# Altium schematic sheet Sheet1.SchDoc: Flight Computer Prototype
size A4; Organization: Altium Limited; Address1: L3, 12a Rodborough Rd; Address2: Frenchs Forest; Address3: NSW; Address4: Australia 2086; Revision: 1.0; SheetNumber: 1; SheetTotal: 4
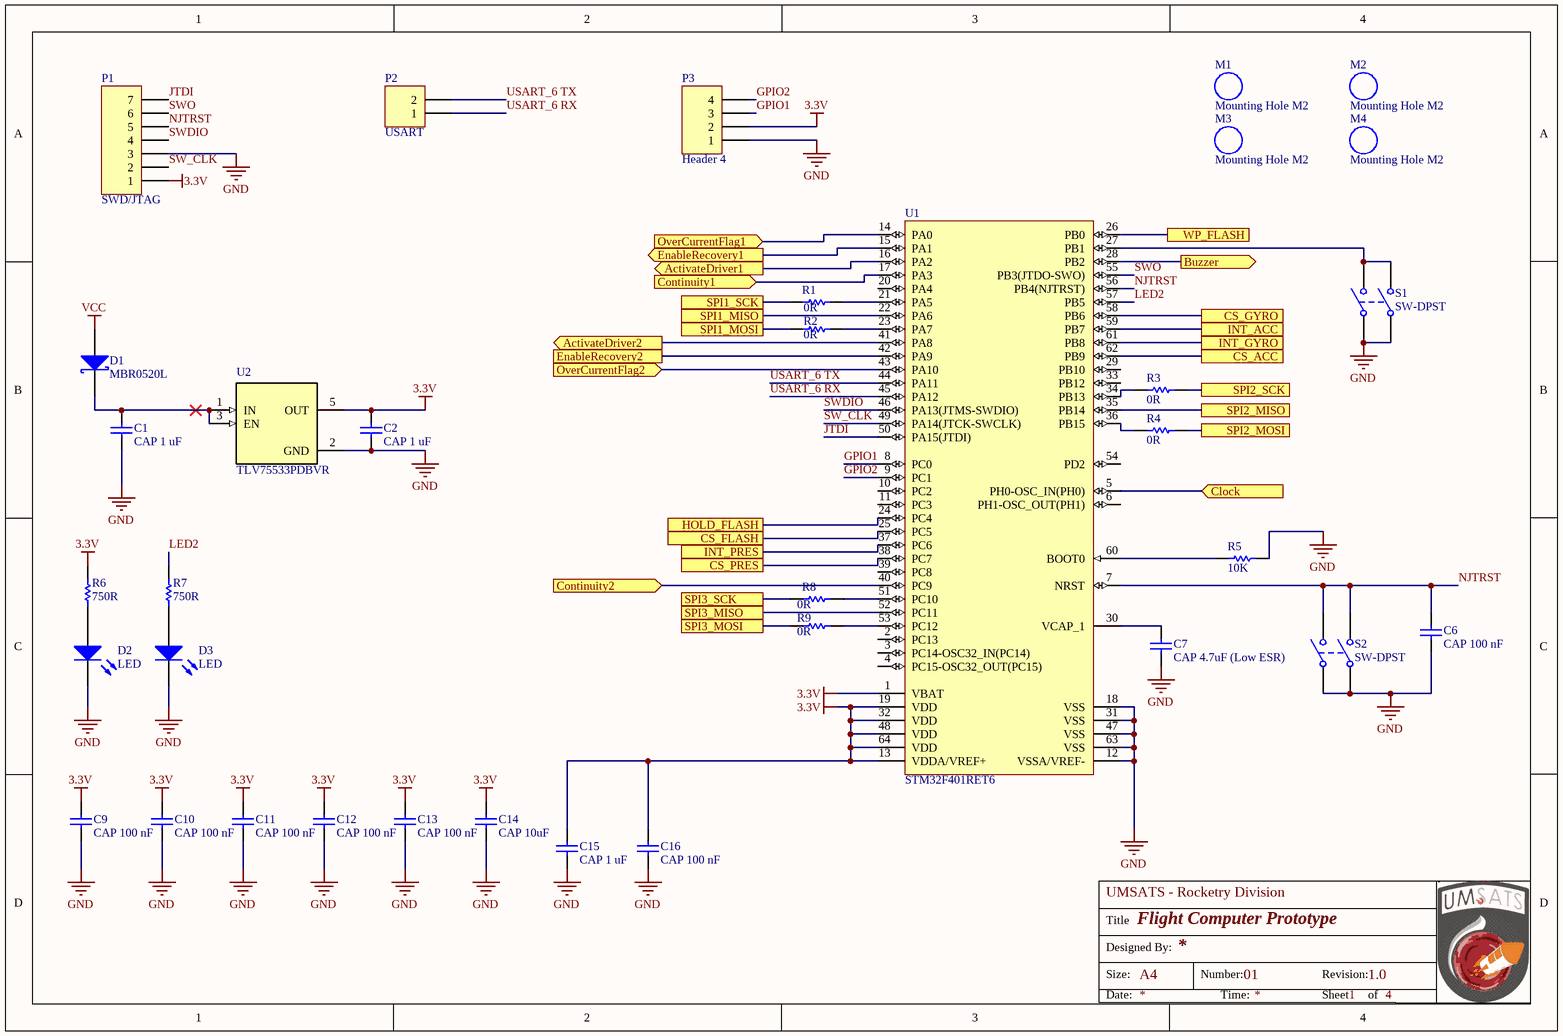
[diagram p0: Sheet1.SchDoc]

## Parts
C1  CAP 1 uF  [CL10A105KB8NNNC]
C2  CAP 1 uF  [CL10A105KB8NNNC]
C6  CAP 100 nF  [06035C104KAT4A]
C7  CAP 4.7uF (Low ESR)  [CGA5L1X7R1E475K160AC]
C9  CAP 100 nF  [06035C104KAT4A]
C10  CAP 100 nF  [06035C104KAT4A]
C11  CAP 100 nF  [06035C104KAT4A]
C12  CAP 100 nF  [06035C104KAT4A]
C13  CAP 100 nF  [06035C104KAT4A]
C14  CAP 10uF  [CL31A106KAHNFNE]
C15  CAP 1 uF  [CL10A105KB8NNNC]
C16  CAP 100 nF  [06035C104KAT4A]
D1  MBR0520L  [ON_Semi_CASE_425_0]
D2  LED  [Vishay VLMx20 Low Current Mini SMD LED]
D3  LED  [Vishay VLMx20 Low Current Mini SMD LED]
M1  Mounting Hole M2  [Mounting Hole M2]
M2  Mounting Hole M2  [Mounting Hole M2]
M3  Mounting Hole M2  [Mounting Hole M2]
M4  Mounting Hole M2  [Mounting Hole M2]
P1  SWD/JTAG  [HDR1X7]
P2  USART  [HDR1X2]
P3  Header 4  [HDR1X4]
R1  0R  [CR0603-J/-000ELF]
R2  0R  [CR0603-J/-000ELF]
R3  0R  [CR0603-J/-000ELF]
R4  0R  [CR0603-J/-000ELF]
R5  10K  [RK73H1JTTD1002F]
R6  750R  [CRCW0603750RFKEA]
R7  750R  [CRCW0603750RFKEA]
R8  0R  [CR0603-J/-000ELF]
R9  0R  [CR0603-J/-000ELF]
S1  SW-DPST  [PTS530GG065SMTRLFS]
S2  SW-DPST  [PTS530GG065SMTRLFS]
U1  STM32F401RET6  [STM-LQFP64_N]
U2  TLV75533PDBVR  [SOT95P280X145-5N]

## Ports
ActivateDriver1 (out), ActivateDriver2 (out), Buzzer (out), Clock (in), Continuity1 (in), Continuity2 (in), CS_ACC, CS_FLASH, CS_GYRO, CS_PRES, EnableRecovery1 (out), EnableRecovery2, HOLD_FLASH, INT_ACC, INT_GYRO, INT_PRES, OverCurrentFlag1 (in), OverCurrentFlag2 (in), SPI1_MISO, SPI1_MOSI, SPI1_SCK, SPI2_MISO, SPI2_MOSI, SPI2_SCK, SPI3_MISO, SPI3_MOSI, SPI3_SCK, WP_FLASH

## Nets
3.3V: C2.1 C9.1 C10.1 C11.1 C12.1 C13.1 C14.2 C15.1 C16.1 P1.1 P3.2 R6.2 U1.1(VBAT) U1.13(VDDA/VREF+) U1.19(VDD) U1.32(VDD) U1.48(VDD) U1.64(VDD) U2.5(OUT)
GND: C1.2 C2.2 C6.2 C7.2 C9.2 C10.2 C11.2 C12.2 C13.2 C14.1 C15.2 C16.2 D2.2(K) D3.2(K) P1.3 P3.1 R5.2 S1.1(COMMON1) S1.3(COMMON2) S2.1(COMMON1) S2.3(COMMON2) U1.12(VSSA/VREF-) U1.18(VSS) U1.31(VSS) U1.47(VSS) U1.63(VSS) U2.2(GND)
VCC: D1.1(A)
ActivateDriver1: U1.16(PA2) ; port ActivateDriver1
ActivateDriver2: U1.41(PA8) ; port ActivateDriver2
Buzzer: U1.28(PB2) ; port Buzzer
Clock: U1.5(PH0-OSC_IN(PH0)) ; port Clock
Continuity1: U1.17(PA3) ; port Continuity1
Continuity2: U1.40(PC9) ; port Continuity2
CS_ACC: U1.62(PB9) ; port CS_ACC
CS_FLASH: U1.25(PC5) ; port CS_FLASH
CS_GYRO: U1.58(PB6) ; port CS_GYRO
CS_PRES: U1.38(PC7) ; port CS_PRES
EnableRecovery1: U1.15(PA1) ; port EnableRecovery1
EnableRecovery2: U1.42(PA9) ; port EnableRecovery2
GPIO1: P3.3 U1.8(PC0)
GPIO2: P3.4 U1.9(PC1)
HOLD_FLASH: U1.24(PC4) ; port HOLD_FLASH
INT_ACC: U1.59(PB7) ; port INT_ACC
INT_GYRO: U1.61(PB8) ; port INT_GYRO
INT_PRES: U1.37(PC6) ; port INT_PRES
JTDI: P1.7 U1.50(PA15(JTDI))
LED2: R7.2 U1.57(PB5)
NJTRST: C6.1 P1.5 S2.2(NO1) S2.4(NO2) U1.7(NRST) U1.56(PB4(NJTRST))
OverCurrentFlag1: U1.14(PA0) ; port OverCurrentFlag1
OverCurrentFlag2: U1.43(PA10) ; port OverCurrentFlag2
SPI1_MISO: U1.22(PA6) ; port SPI1_MISO
SPI1_MOSI: R2.1 ; port SPI1_MOSI
SPI1_SCK: R1.1 ; port SPI1_SCK
SPI2_MISO: U1.35(PB14) ; port SPI2_MISO
SPI2_MOSI: R4.2 ; port SPI2_MOSI
SPI2_SCK: R3.2 ; port SPI2_SCK
SPI3_MISO: U1.52(PC11) ; port SPI3_MISO
SPI3_MOSI: R9.1 ; port SPI3_MOSI
SPI3_SCK: R8.1 ; port SPI3_SCK
SW_CLK: P1.2 U1.49(PA14(JTCK-SWCLK))
SWDIO: P1.4 U1.46(PA13(JTMS-SWDIO))
SWO: P1.6 U1.55(PB3(JTDO-SWO))
USART_6 RX: P2.1 U1.45(PA12)
USART_6 TX: P2.2 U1.44(PA11)
WP_FLASH: U1.26(PB0) ; port WP_FLASH
NetC1_1: C1.1 D1.2(K) U2.1(IN) U2.3(EN)
NetC7_1: C7.1 U1.30(VCAP_1)
NetD2_1: D2.1(A) R6.1
NetD3_1: D3.1(A) R7.1
NetR1_2: R1.2 U1.21(PA5)
NetR2_2: R2.2 U1.23(PA7)
NetR3_1: R3.1 U1.34(PB13)
NetR4_1: R4.1 U1.36(PB15)
NetR5_1: R5.1 U1.60(BOOT0)
NetR8_2: R8.2 U1.51(PC10)
NetR9_2: R9.2 U1.53(PC12)
NetS1_2: S1.2(NO1) S1.4(NO2) U1.27(PB1)

Not connected (* = marked no-connect by the designer): U1 2(PC13) 3(PC14-OSC32_IN(PC14)) 4(PC15-OSC32_OUT(PC15)) 6(PH1-OSC_OUT(PH1)) 10(PC2) 11(PC3) 20(PA4) 29(PB10) 33(PB12) 39(PC8) 54(PD2)

## Notes on the sheet
- Title
- UMSATS - Rocketry Division
- Designed By:
- Size:
- A4
- Number:
- 01
- Revision:
- Date:
- Time:
- Sheet
- of

## Library data of the parts
C1 C2 C6 C7 C9-C16 = Cap: Capacitor; Published: 8-Jun-2000; LatestRevisionDate: 17-Jul-2002; LatestRevisionNote: Re-released for DXP Platform.; Publisher: Altium Limited
  C14: PackageReference: RAD-0.3; PackageDescription: Radial Cap, Thru-Hole; 2 Leads; 0.3 in Pin Spacing; Value: 10uF
D1 = MBR0520L: Schottky Diode; Manufacturer: ON Semiconductor / Fairchild; Average Rectified Current: 500mA; Max Reverse Voltage (DC): 20V; Element Configuration: Single; Forward Voltage: 385mV; Max Surge Current: 5.5A; Peak Reverse Current: 250uA; Polarity: Standard; Power Dissipation: 400mW; Capacitance: 4pF; Current Rating: 500A; Manufacturer Part Number: MBR0520L; RoHS: Yes; Mount: Surface Mount; Number of Pins: 2; Weight: 0.03g; Min Operating Temperature: -65°C; Max Operating Temperature: 125°C; Packaging: Tape and Reel; Package Quantity: 3000; Max Forward Surge Current (Ifsm): 5.5A; Forward Current: 500mA; Max Repetitive Reverse Voltage (Vrrm): 20V; Peak Non-Repetitive Surge Current: 5.5A; Max Reverse Leakage Current: 250uA; Voltage Rating (DC): 20V; Output Current: 500mA; Length: 2.7mm; Height: 1.03mm; Width: 1.6mm; Radiation Hardening: No; Lead Free: Lead Free; REACH SVHC: No SVHC; ComponentLink1URL: http://www.farnell.com/datasheets/2304093.pdf?src-supplier=Farnell; ComponentLink1Description: http://www.farnell.com/datasheets/2304093.pdf?src-supplier=Farnell; ComponentLink2URL: http://www.mouser.com/ds/2/149/MBR0520L-67539.pdf?src-supplier=Mouser; ComponentLink2Description: http://www.mouser.com/ds/2/149/MBR0520L-67539.pdf?src-supplier=Mouser; ComponentLink3URL: https://www.fairchildsemi.com/datasheets/MB/MBR0520L.pdf?src-supplier=Digi-Key; ComponentLink3Description: https://www.fairchildsemi.com/datasheets/MB/MBR0520L.pdf?src-supplier=Digi-Key; ComponentLink4URL: https://www.fairchildsemi.com/datasheets/MB/MBR0520L.pdf?src-supplier=Avnet; ComponentLink4Description: https://www.fairchildsemi.com/datasheets/MB/MBR0520L.pdf?src-supplier=Avnet; ComponentLink5URL: http://www.fairchildsemi.com/ds/MB/MBR0520L.pdf?src-supplier=Avnet+Europe; ComponentLink5Description: http://www.fairchildsemi.com/ds/MB/MBR0520L.pdf?src-supplier=Avnet+Europe; ComponentLink6URL: http://www.jameco.com/Jameco/Products/ProdDS/871594.pdf?src-supplier=Jameco; ComponentLink6Description: http://www.jameco.com/Jameco/Products/ProdDS/871594.pdf?src-supplier=Jameco; ComponentLink7URL: http://www.fairchildsemi.com/ds/MB/MBR0520L.pdf?src-supplier=Future+Electronics; ComponentLink7Description: http://www.fairchildsemi.com/ds/MB/MBR0520L.pdf?src-supplier=Future+Electronics; ComponentLink8URL: http://www.farnell.com/datasheets/48015.pdf?src-supplier=Element14; ComponentLink8Description: http://www.farnell.com/datasheets/48015.pdf?src-supplier=Element14; Supplier 1: Digi-Key; Supplier 2: Future Electronics
D2 D3 = LED2: Typical RED, GREEN, YELLOW, AMBER GaAs LED; Published: 8-Jun-2000; LatestRevisionDate: 17-Jul-2002; LatestRevisionNote: Re-released for DXP Platform.; PackageVersion: Feb-2002; PackageReference: 3.2X1.6X1.1; Publisher: Altium Limited; PackageDescription: SM LED; 2 Flat Leads
P1 = Header 7: Header, 7-Pin; LatestRevisionDate: 17-Jul-2002; LatestRevisionNote: Re-released for DXP Platform.; Publisher: Altium Limited
P2 = Header 2: Header, 2-Pin; LatestRevisionDate: 17-Jul-2002; LatestRevisionNote: Re-released for DXP Platform.; Publisher: Altium Limited
P3 = Header 4: Header, 4-Pin; LatestRevisionDate: 17-Jul-2002; LatestRevisionNote: Re-released for DXP Platform.; Publisher: Altium Limited
R1-R9 = Res1: Resistor; Value: 1K; Published: 8-Jun-2000; LatestRevisionDate: 17-Jul-2002; LatestRevisionNote: Re-released for DXP Platform.; PackageReference: AXIAL-0.3; Publisher: Altium Limited; PackageDescription: Axial Device, Thru-Hole; 2 Leads; 0.3 in Pin Spacing
S1 S2 = SW-DPST: Double-Pole, Single-Throw Switch; Published: 24-Mar-1999; LatestRevisionDate: 17-Jul-2002; LatestRevisionNote: Re-released for DXP Platform.; PackageReference: DPST-4; Publisher: Altium Limited; PackageDescription: Switch; 4 Leads
U1 = STM32F401RET6: ARM Cortex-M4 32-bit MCU+FPU, 512 KB Flash, 96 KB Internal RAM, 50 I/Os, 64-Pin LQFP, -40 to 85 degC, Tray; Supply Voltage(Vcc) min (V): 1.7; Internal RAM Size (kB): 96; I/Os (High Current): 50; Operating Frequency(F) (Processor speed) (MHz): 84; FLASH Size (Prog) (kB): 512; Package Reference: 64-Pin Low-profile Quad Flat Package, Body 10 x 10 mm, Pitch 0.5 mm; Packing: Tray; DatasheetVersion: Rev. 3; Mounting Technology: Surface Mount; ComponentLink1Description: Manufacturer URL; Package Description: LQFP64; Core: ARM Cortex-M4; ComponentLink1URL: http://www.st.com/; ComponentLink2URL: http://www.st.com/st-web-ui/static/active/en/resource/technical/document/datasheet/DM00102166.pdf; ComponentLink2Description: Datasheet
U2 = TLV75533PDBVR: 500mA Low-IQ Small-Size Low-Dropout _LDO_ Regulator 5-SOT-23 -40 to 125; MF: Texas Instruments; Package: SOT-23 Texas Instruments; MP: TLV75533PDBVR; SnapEDA_Link: https://www.snapeda.com/parts/TLV75533PDBVR/Texas%20Instruments/view-part/?ref=snap; Availability: Unavailable; Price: None; Value: *